# Altium schematic sheet LithiumUHV.SchDoc
size A
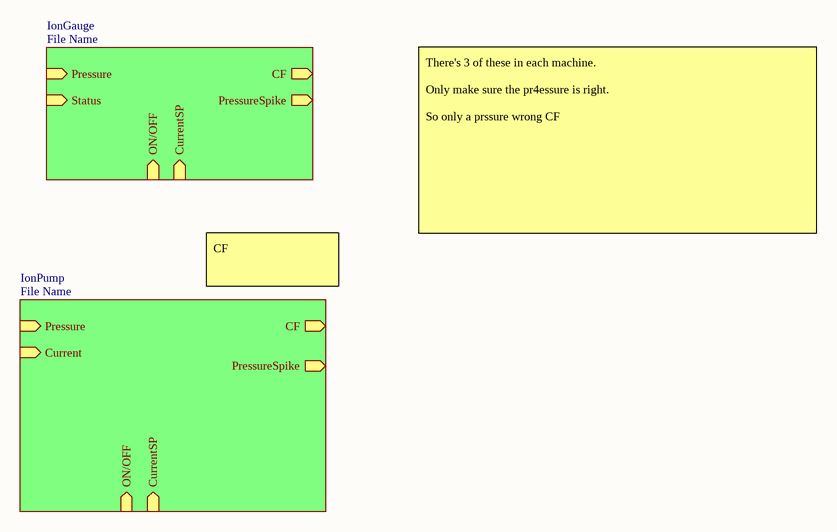
[diagram p0: LithiumUHV.SchDoc]

## Sub-sheets
IonGauge = File Name: Pressure (in), Status (in), CF (out), PressureSpike (out), ON/OFF (in), CurrentSP (in)
IonPump = File Name: Pressure (in), CurrentSP (in), CF (out), Current (in), ON/OFF (in), PressureSpike (out)

## Notes on the sheet
- There's 3 of these in each machine.
  Only make sure the pr4essure is right.
  So only a prssure wrong CF
- CF